# Altium schematic sheet POV_LED.SchDoc
size A4
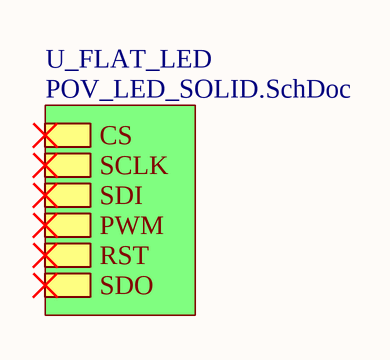
[diagram p0: POV_LED.SchDoc]

## Sub-sheets
U_FLAT_LED = POV_LED_SOLID.SchDoc: SCLK, CS, RST, PWM, SDI, SDO